# EAGLE design mega (EAGLE 6.6.0)
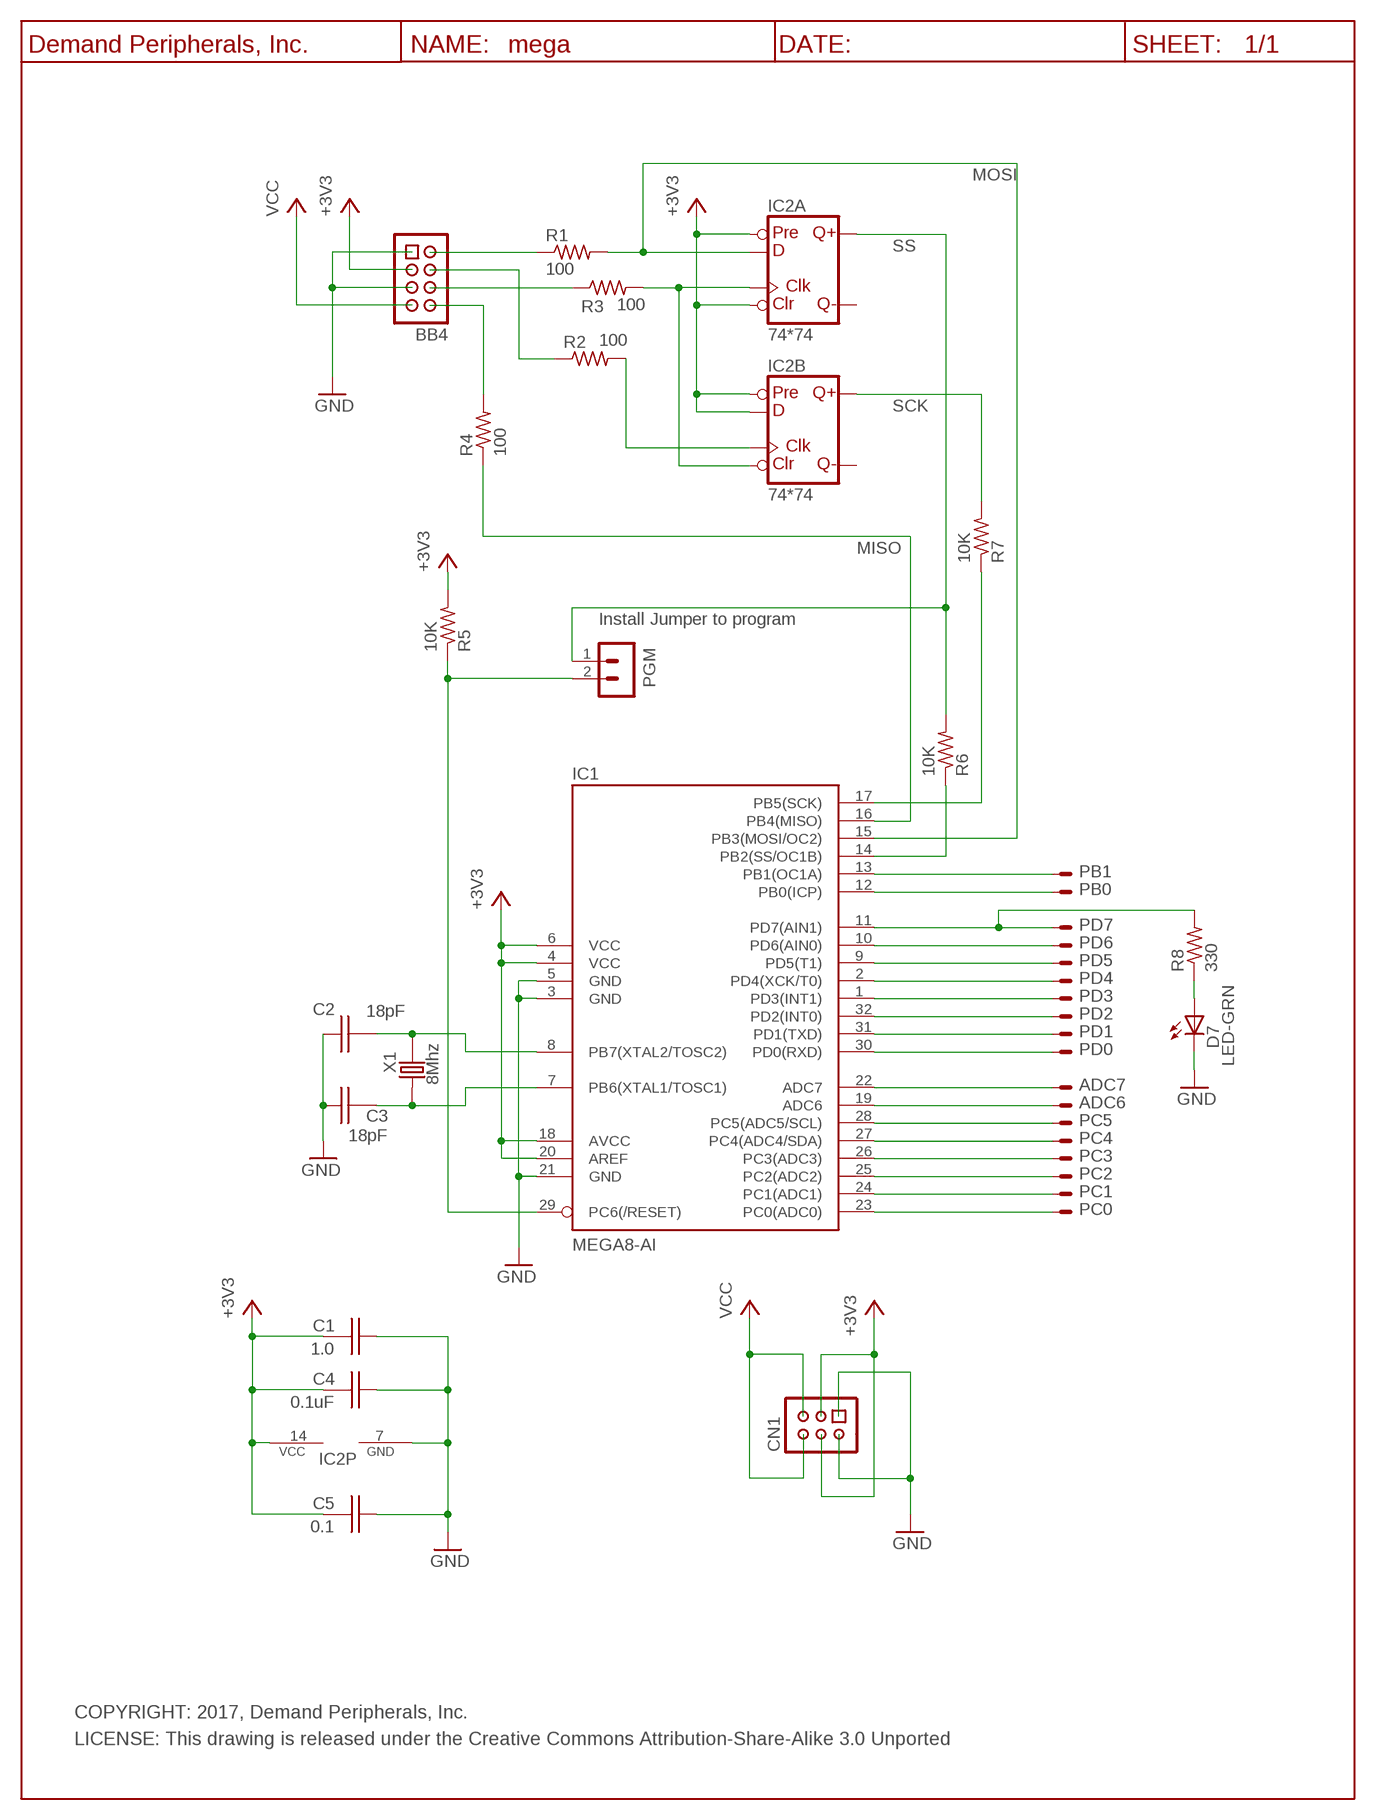
[diagram p0: schematic, sheet 1]

## Parts
ADC6  PinHdr254-1(Option)  PAD1  [PAD1]
ADC7  PinHdr254-1(Option)  PAD1  [PAD1]
BB4  BB4_CON  HDR-4X2-SHR  [HDR-4X2]
C1  1.0  C1.0UF_C0603  [C0603]
C2  18pF  C18PF_C0603  [C0603]
C3  18pF  C18PF_C0603  [C0603]
C4  0.1uF  C0.1UF_C0603  [C0603]
C5  0.1  C0.1UF_C0603  [C0603]
CN1  HDR-3X2  [HDR-3X2]
D7  LED-GRN  LED-0805-GRN  [0805]
IC1  MEGA8-AI  [TQFP32-08]
IC2  74*74  74AHC74TS  [TSSOP14]
PB0  PinHdr254-1(Option)  PAD1  [PAD1]
PB1  PinHdr254-1(Option)  PAD1  [PAD1]
PC0  PinHdr254-1(Option)  PAD1  [PAD1]
PC1  PinHdr254-1(Option)  PAD1  [PAD1]
PC2  PinHdr254-1(Option)  PAD1  [PAD1]
PC3  PinHdr254-1(Option)  PAD1  [PAD1]
PC4  PinHdr254-1(Option)  PAD1  [PAD1]
PC5  PinHdr254-1(Option)  PAD1  [PAD1]
PD0  PinHdr254-1(Option)  PAD1  [PAD1]
PD1  PinHdr254-1(Option)  PAD1  [PAD1]
PD2  PinHdr254-1(Option)  PAD1  [PAD1]
PD3  PinHdr254-1(Option)  PAD1  [PAD1]
PD4  PinHdr254-1(Option)  PAD1  [PAD1]
PD5  PinHdr254-1(Option)  PAD1  [PAD1]
PD6  PinHdr254-1(Option)  PAD1  [PAD1]
PD7  PinHdr254-1(Option)  PAD1  [PAD1]
PGM  PinHdr254-2  HDR-2X1-LCK  [HDR-2X1]
R1  100  R100_R0603  [R0603]
R2  100  R100_R0603  [R0603]
R3  100  R100_R0603  [R0603]
R4  100  R100_R0603  [R0603]
R5  10K  R10K_R0603  [R0603]
R6  10K  R10K_R0603  [R0603]
R7  10K  R10K_R0603  [R0603]
R8  330  R330_R0603  [R0603]
U$1  DP_FRAME_P  [P_FRAME]
X1  8Mhz  NX5032-8MM5X32  [NX5032]

## Nets
+3V3: BB4.3 C1.2 C4.2 C5.2 CN1.3 CN1.4 IC1.4(VCC) IC1.6(VCC) IC1.18(AVCC) IC1.20(AREF) IC2.1(A:CLR) IC2.4(A:PRE) IC2.10(B:PRE) IC2.12(B:D) IC2.14(P:VCC) R5.2
GND: BB4.1 BB4.5 C1.1 C2.1 C3.1 C4.1 C5.1 CN1.1 CN1.2 D7.C IC1.3(GND) IC1.5(GND) IC1.21(GND) IC2.7(P:GND)
N$1: IC1.29(PC6(/RESET)) PGM.2 R5.1
N$2: D7.A R8.1
N$3: C3.2 IC1.7(PB6(XTAL1/TOSC1)) X1.2
N$4: C2.2 IC1.8(PB7(XTAL2/TOSC2)) X1.1
N$14: IC1.23(PC0(ADC0)) PC0.1
N$18: IC1.26(PC3(ADC3)) PC3.1
N$19: IC1.24(PC1(ADC1)) PC1.1
N$20: IC1.25(PC2(ADC2)) PC2.1
N$21: IC1.27(PC4(ADC4/SDA)) PC4.1
N$22: IC1.28(PC5(ADC5/SCL)) PC5.1
N$23: ADC6.1 IC1.19(ADC6)
N$24: ADC7.1 IC1.22(ADC7)
N$25: IC1.30(PD0(RXD)) PD0.1
N$26: IC1.31(PD1(TXD)) PD1.1
N$27: IC1.32(PD2(INT0)) PD2.1
N$28: IC1.1(PD3(INT1)) PD3.1
N$29: IC1.2(PD4(XCK/T0)) PD4.1
N$30: IC1.9(PD5(T1)) PD5.1
N$31: IC1.10(PD6(AIN0)) PD6.1
N$32: IC1.11(PD7(AIN1)) PD7.1 R8.2
N$33: IC1.12(PB0(ICP)) PB0.1
N$34: IC1.13(PB1(OC1A)) PB1.1
N$154: BB4.2 R1.1
N$155: IC1.15(PB3(MOSI/OC2)) IC2.2(A:D) R1.2
N$156: BB4.4 R2.1
N$157: IC2.11(B:CLK) R2.2
N$158: IC2.3(A:CLK) IC2.13(B:CLR) R3.2
N$159: BB4.6 R3.1
N$160: IC2.9(B:Q) R7.2
N$161: IC2.5(A:Q) PGM.1 R6.2
N$162: IC1.16(PB4(MISO)) R4.1
N$163: BB4.8 R4.2
N$165: IC1.14(PB2(SS/OC1B)) R6.1
N$166: IC1.17(PB5(SCK)) R7.1
VCC: BB4.7 CN1.5 CN1.6
Unconnected: IC2.6(A:!Q) IC2.8(B:!Q)

## Notes on the sheet
- MOSI
- SS
- SCK
- MISO
- Install Jumper to program
- COPYRIGHT: 2017, Demand Peripherals, Inc.
- LICENSE: This drawing is released under the Creative Commons Attribution-Share-Alike 3.0 Unported

## Library data of the parts
ADC6 ADC7 PB0 PB1 PC0 PC1-PC5 PD0 PD1-PD7 = dpi-conn:PAD1: WW PAD
BB4 = dpi-conn:HDR-4X2-SHR: Shrouded 4x2 pin header; VENDOR: Digikey; VENDOR-PART-NUM: 609-3530-ND
C1 = dpi-passive:C1.0UF_: 1.0 uF Capacitor, 25V, Y5V; VENDOR: Digikey; VENDOR-PART-NUM: 490-3897-2-ND
C2 C3 = dpi-passive:C18PF_: 18 pF Capacitor, 50V; VENDOR: Digikey; VENDOR-PART-NUM: 311-1061-1-ND
C4 C5 = dpi-passive:C0.1UF_: 0.1 uF Capacitor, 25V, X7R; VENDOR: Digikey; VENDOR-PART-NUM: 1276-1126-2-ND
CN1 = dpi-conn:HDR-3X2: Unshrouded 3x2 header with 0.1 inch pitch; VENDOR: Digikey; VENDOR-PART-NUM: 952-2120-ND
D7 = dpi-diopto:LED-0805-GRN: Green 0805 LED, 26mcd@20ma, 160degree; VENDOR: Digikey; VENDOR-PART-NUM: 475-1410-1-ND
IC1 = dpi-transic:MEGA8: Atmel ARV Mega8
IC2 = dpi-transic:74AHC74: Dual D type positive edge triggered FLIP FLOP, preset and clear; VENDOR: Digikey; VENDOR-PART-NUM: MC74HC74ADTR2GOSCT-ND
PGM = dpi-conn:HDR-2X1-LCK: 2x1 pin header with friction lock; VENDOR: Mouser; VENDOR-PART-NUM: 571-6404562
R1-R4 = dpi-passive:R100_: 100 Ohm resistor, 1%, 0.1 watt; VENDOR: Digikey; VENDOR-PART-NUM: 311-100HRTR-ND
R5-R7 = dpi-passive:R10K_: 10K Resistor, 1%, 0.1 watt; VENDOR: Digikey; VENDOR-PART-NUM: 311-1.00KHRTR-ND
R8 = dpi-passive:R330_: 330 Ohm resistor, 1%, 0.1 watt; VENDOR: Digikey; VENDOR-PART-NUM: 311-330HRTR-ND
U$1 = dpi-sym:DP_FRAME_P: Portrait/Letter Document Frame
X1 = dpi-passive:NX5032-8: NDK 8 MHz crystal; VENDOR: Digikey; VENDOR-PART-NUM: 644-1318-1-ND

## Board
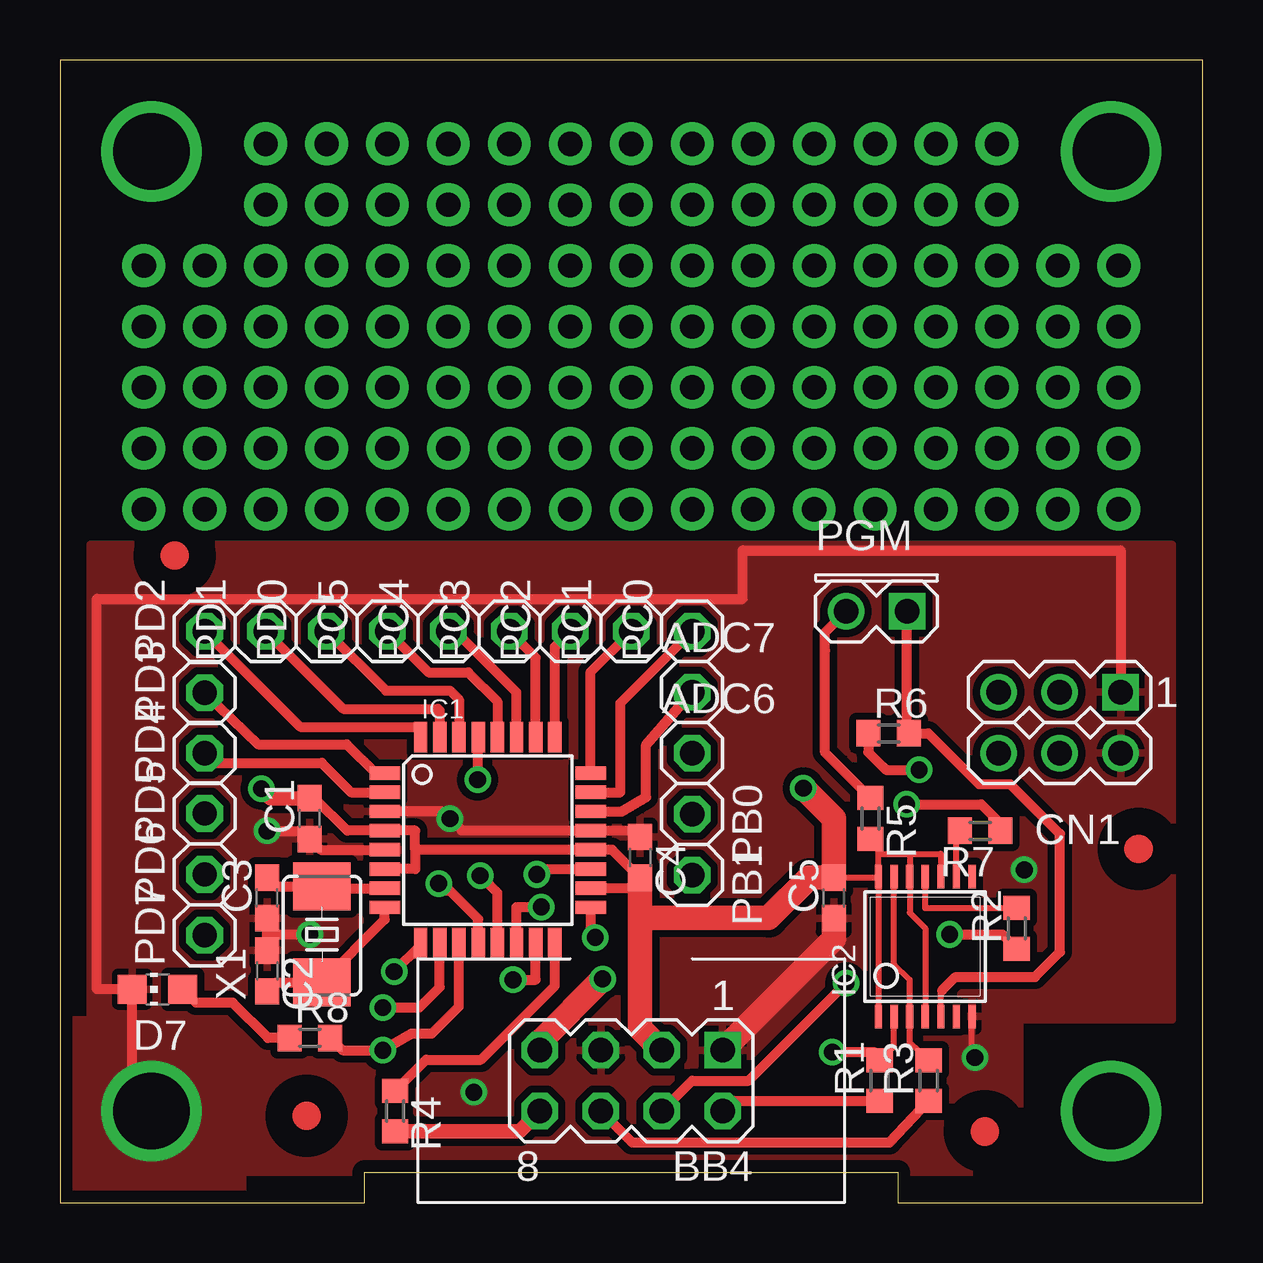
[diagram p1: board, top side]
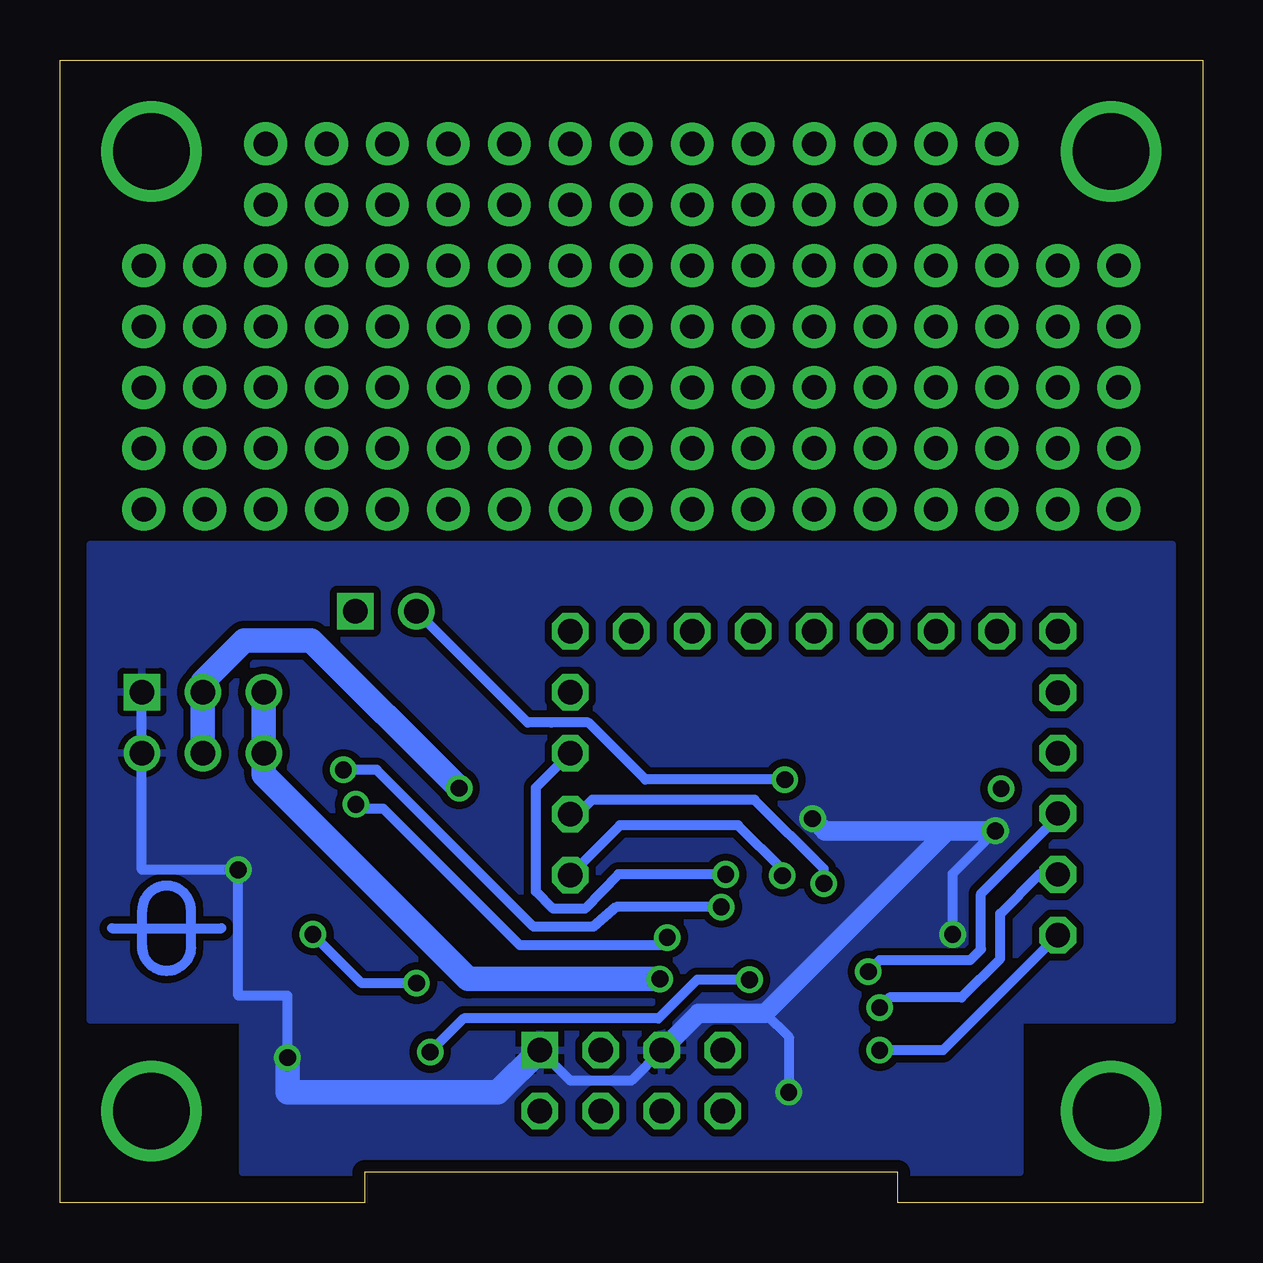
[diagram p2: board, bottom side, seen from below]

Size 47.62 x 47.62 mm. Coordinates in mm from the lower left corner, seen from the top.
Outline: 0,0 12.7,0 12.7,1.27 34.92,1.27 34.92,0 47.62,0 47.62,47.62 0,47.62 0,0
Copper layers (1*16): Top 0.035mm / dielectric 1.5mm / Bottom 0.035mm
Design rules "default": minimum track width 10mil, minimum drill 24mil, track to track 8mil, track to pad 8mil, pad to pad 8mil, via to via 8mil, smd to smd 8mil, copper to edge 20mil, drill to drill 12mil, minimum pad ring 10mil, minimum via ring 8mil, stop-mask expansion 4mil, vias tented up to drill 0mil, thermal gap 10mil
tKeepout: area 15.1,1 to 32.5,9.7; area 15.1,1 to 32.5,9.7

### Footprints (pad centres in the part's own frame; a part is rotated, then mirrored left to right if it is on the bottom)
PAD1 = drill 1.016 octagon: 1 0,0
HDR-4X2 = drill 1.016 square: 1 -3.81,-1.27 | drill 1.016 octagon: 2 -3.81,1.27; 3 -1.27,-1.27; 4 -1.27,1.27; 5 1.27,-1.27; 6 1.27,1.27; 7 3.81,-1.27; 8 3.81,1.27
C0603 = smd 1.1 x 1: 1 -0.85,0; 2 0.85,0
HDR-3X2 = drill 1.016 square: 1 -2.54,-1.27 | drill 1.016: 2 -2.54,1.27; 3 0,-1.27; 4 0,1.27; 5 2.54,-1.27; 6 2.54,1.27
0805 = smd 1.2 x 1.2: A 0,-1.05; C 0,1.05
TQFP32-08 = smd 1.27 x 0.559: 1 -4.293,2.8; 2 -4.293,2; 3 -4.293,1.2; 4 -4.293,0.4; 5 -4.293,-0.4; 6 -4.293,-1.2; 7 -4.293,-2; 8 -4.293,-2.8; 17 4.293,-2.8; 18 4.293,-2; 19 4.293,-1.2; 20 4.293,-0.4; 21 4.293,0.4; 22 4.293,1.2; 23 4.293,2; 24 4.293,2.8 | smd 0.559 x 1.27: 9 -2.8,-4.293; 10 -2,-4.293; 11 -1.2,-4.293; 12 -0.4,-4.293; 13 0.4,-4.293; 14 1.2,-4.293; 15 2,-4.293; 16 2.8,-4.293; 25 2.8,4.293; 26 2,4.293; 27 1.2,4.293; 28 0.4,4.293; 29 -0.4,4.293; 30 -1.2,4.293; 31 -2,4.293; 32 -2.8,4.293
TSSOP14 = smd 0.305 x 0.991: 1 -1.95,-2.918; 2 -1.3,-2.918; 3 -0.65,-2.918; 4 0,-2.918; 5 0.65,-2.918; 6 1.3,-2.918; 7 1.95,-2.918; 8 1.95,2.918; 9 1.3,2.918; 10 0.65,2.918; 11 0,2.918; 12 -0.65,2.918; 13 -1.3,2.918; 14 -1.95,2.918
HDR-2X1 = drill 1.016 square: 1 1.27,0 | drill 1.016: 2 -1.27,0
R0603 = smd 1 x 1.1: 1 -0.85,0; 2 0.85,0
NX5032 = smd 2 x 2.4: 1 -2,0; 2 2,0

### Placement (x,y rotation side)
ADC6  26.35,18.73 0 top
ADC7  26.35,21.27 0 top
BB4  23.81,5.08 180 top
C1  10.41,16 90 top
C2  8.64,9.65 270 top
C3  8.64,12.7 90 top
C4  24.17,14.39 270 top
C5  32.26,12.7 90 top
CN1  41.67,20 180 top
D7  4.06,8.89 90 top
IC1  17.83,15.1 0 top
IC2  36.07,10.67 0 top
PB0  26.35,16.19 270 top
PB1  26.35,13.65 270 top
PC0  26.35,23.81 90 top
PC1  23.81,23.81 90 top
PC2  21.27,23.81 90 top
PC3  18.73,23.81 90 top
PC4  16.19,23.81 90 top
PC5  13.65,23.81 90 top
PD0  11.11,23.81 90 top
PD1  8.57,23.81 90 top
PD2  6.03,23.81 90 top
PD3  6.03,21.25 90 top
PD4  6.03,18.73 90 top
PD5  6.03,16.22 90 top
PD6  6.03,13.68 90 top
PD7  6.03,11.14 90 top
PGM  34.04,24.64 0 top
R1  34.16,5.08 90 top
R2  39.88,11.43 90 top
R3  36.21,5.08 90 top
R4  13.97,3.81 270 top
R5  33.78,16.01 270 top
R6  34.54,19.56 0 top
R7  38.35,15.49 180 top
R8  10.41,6.86 0 top
U$1  0,0 0 top
U$2  [DPI-1]  43.18,11.43 90 bottom
U$4  [FIDUCIAL]  10.29,3.61 0 top
U$5  [FIDUCIAL]  38.56,2.96 0 top
U$6  [FIDUCIAL]  44.96,14.73 0 top
U$7  [FIDUCIAL]  4.78,26.97 0 top
X1  10.92,11.18 90 top

### Tracks (layer width: path | path; a pad name or v marks a point on that pad's centre or on a via)
+3V3  (via drill 0.7)
  Top 0.254: 34.12,14.54 IC2.14 34.08,13.55 | 34.12,14.54 34.12,14.83 R5.2 | C5.2 34.08,13.55 | IC2.10 36.72,14.54 35.42,14.54 | 35.42,14.54 IC2.12 35.42,12.08 36.07,11.43 IC2.4 | 34.12,14.54 35.42,14.54 | 34.08,13.55 34.12,13.51 IC2.1
  Top 0.406: IC1.6 14.81,13.9 14.81,14.7 | 14.81,14.7 14.81,15.5 IC1.4 11.97,15.5 10.62,16.85 C1.2 | 14.81,14.7 IC1.20 23.01,14.7 C4.2 23.73,13.1 IC1.18
  Top 0.61: v8.39,17.25 8.79,16.85 C1.2
  Top 1.016: BB4.3 24.17,7.26 C4.2 24.17,11.86 29.54,11.86 31.23,13.55 C5.2 32.26,16 v30.99,17.27
  Bottom 1.016: v30.99,17.27 37.15,23.43 37.35,23.43 39.94,23.43 41.67,21.7 CN1.3 CN1.4
GND  (via drill 0.7, 3.17 pad 3.17)
  Top 0.254: IC2.7 38.02,6.17 v38.14,6.04
  Top 0.406: IC1.5 10.87,14.7 C1.1 10.07,15.49 v8.64,15.49 | IC1.3 15.96,16.3 v16.26,16 16.76,15.5 IC1.21 23.91,15.5 C4.1 | C2.1 C3.1 8.64,11.18 v10.41,11.18 | v3.81,3.81 3.01,4.61 D7.C 1.54,8.89 1.54,25.16 28.46,25.16 28.46,27.18 44.21,27.18 CN1.1
  Top 1.016: C5.1 32.26,10.99 BB4.1
  Bottom 0.406: v10.41,11.18 10.41,13.72 v8.64,15.49 | BB4.5 23.81,5.08 26.35,5.08 BB4.1 | 18.24,7.89 17.25,6.9 v17.25,4.6 | v38.14,6.04 38.14,8.62 40.2,8.62 v40.2,13.87 44.13,13.87 44.21,13.87 CN1.2 CN1.1
  Bottom 0.813: BB4.5 21.01,7.89 18.24,7.89 10.63,15.49 v8.64,15.49 15.75,15.49 v16.26,16
  Bottom 1.016: v38.14,6.04 38.14,4.58 29.39,4.58 BB4.1
  pour Bottom (isolate 0.305): 1.27,7.62 1.27,27.43 46.35,27.43 46.35,7.62 40.01,7.62 40.01,1.27 7.62,1.27 7.62,7.62
  pour Top (isolate 0.305): 1.27,7.62 1.27,27.43 46.35,27.43 46.35,7.62 40.01,7.62 40.01,1.27 7.62,1.27 7.62,0.51 0.51,0.51 0.51,7.62
MOUNT  (via drill 3.17 pad 3.17)
  other vias: 43.81,43.81
N$1  (via drill 0.7)
  Top 0.406: IC1.29 17.43,17.65 v17.41,17.63 | R5.1 31.89,18.76 31.89,23 31.89,23.76 PGM.2
  Bottom 0.406: v17.41,17.63 23.23,17.63 25.6,20 27.14,20 28.13,20 PGM.2
N$2
  Top 0.406: R8.1 8.67,6.86 7.2,8.33 5.67,8.33 D7.A
N$3
  Top 0.406: IC1.7 11,13.1 X1.2 9.01,13.18 C3.2
N$4
  Top 0.406: IC1.8 13.54,11.79 X1.1 9.01,9.18 C2.2
N$5  (via drill 1.02 pad 1.78)
  other vias: 23.81,28.89
N$6  (via drill 1.02 pad 1.78)
  other vias: 44.13,28.89
N$7  (via drill 1.02 pad 1.78)
  other vias: 6.03,31.43
N$8  (via drill 1.02 pad 1.78)
  other vias: 28.89,31.43
N$9  (via drill 1.02 pad 1.78)
  other vias: 23.81,33.97
N$11  (via drill 1.02 pad 1.78)
  other vias: 44.13,33.97
N$12  (via drill 1.02 pad 1.78)
  other vias: 6.03,36.51
N$13  (via drill 1.02 pad 1.78)
  other vias: 28.89,36.51
N$14
  Top 0.406: IC1.23 23.36,17.1 23.36,20.82 PC0.1
N$15  (via drill 1.02 pad 1.78)
  other vias: 23.81,39.05
N$16  (via drill 1.02 pad 1.78)
  other vias: 44.13,39.05
N$17  (via drill 1.02 pad 1.78)
  other vias: 23.81,41.59
N$18
  Top 0.406: IC1.26 19.83,22.71 PC3.1
N$19
  Top 0.406: IC1.24 22.12,22.12 PC1.1
N$20
  Top 0.406: IC1.25 20.63,23.17 PC2.1
N$21
  Top 0.406: IC1.27 19.03,21.27 16.48,23.81 PC4.1
N$22
  Top 0.406: IC1.28 18.23,20.89 17.02,22.1 15.37,22.1 PC5.1
N$23  (via drill 0.7)
  Top 0.406: v19.88,13.68 20.14,13.9 IC1.19
  Bottom 0.406: ADC6.1 27.79,17.3 27.79,12.97 27.06,12.24 25.74,12.24 24.35,13.68 v19.88,13.68
N$24
  Top 0.406: IC1.22 23.41,16.3 24.43,16.9 24.43,19.07 ADC7.1
N$25
  Top 0.406: IC1.30 16.63,20.96 16.26,21.34 13.59,21.34 PD0.1
N$26
  Top 0.406: IC1.31 15.83,20.49 15.75,20.57 11.81,20.57 PD1.1
N$27
  Top 0.406: IC1.32 15.03,19.82 10.02,19.82 PD2.1
N$28
  Top 0.406: IC1.1 13.15,17.9 11.95,19.1 8.26,19.1 PD3.1
N$29
  Top 0.406: IC1.2 12.13,17.1 10.91,18.33 6.51,18.33 PD4.1
N$30  (via drill 0.7)
  Top 0.406: IC1.9 15.03,10.73 v13.93,9.63
  Bottom 0.406: v13.93,9.63 13.46,10.1 9.69,10.1 9.23,10.55 9.23,12.87 6.11,15.99 PD5.1
N$31  (via drill 0.7)
  Top 0.406: IC1.10 15.83,8.97 14.99,8.13 v13.46,8.13
  Bottom 0.406: PD6.1 6.79,13.68 8.43,12.04 8.43,10.16 10.05,8.55 13.04,8.55 v13.46,8.13
N$32  (via drill 0.7)
  Top 0.406: IC1.11 16.63,8.17 15.49,7.04 14.66,7.04 v13.46,6.35 11.77,6.35 R8.2
  Bottom 0.406: PD7.1 10.82,6.35 v13.46,6.35
N$33  (via drill 0.7)
  Top 0.406: IC1.12 17.43,11.82 16.26,12.99 16.09,12.99 v15.79,13.3
  Bottom 0.406: PB0.1 26.04,16.19 25.44,16.79 18.67,16.79 15.79,13.91 v15.79,13.3
N$34  (via drill 0.7)
  Top 0.406: IC1.13 18.23,12.91 v17.51,13.63
  Bottom 0.406: v17.51,13.63 17.51,13.88 19.36,15.72 24.28,15.72 PB1.1
N$36  (via drill 1.02 pad 1.78)
  other vias: 28.89,41.59
N$37  (via drill 1.02 pad 1.78)
  other vias: 23.81,44.13
N$38  (via drill 1.02 pad 1.78)
  other vias: 39.05,44.13
N$39  (via drill 1.02 pad 1.78)
  other vias: 8.57,41.59
N$40  (via drill 1.02 pad 1.78)
  other vias: 8.57,44.13
N$41  (via drill 1.02 pad 1.78)
  other vias: 11.11,44.13
N$42  (via drill 1.02 pad 1.78)
  other vias: 11.11,41.59
N$43  (via drill 1.02 pad 1.78)
  other vias: 13.65,41.59
N$44  (via drill 1.02 pad 1.78)
  other vias: 13.65,44.13
N$45  (via drill 1.02 pad 1.78)
  other vias: 16.19,44.13
N$46  (via drill 1.02 pad 1.78)
  other vias: 16.19,41.59
N$47  (via drill 3.17 pad 3.17)
  other vias: 3.81,43.81
N$48  (via drill 1.02 pad 1.78)
  other vias: 18.73,41.59
N$49  (via drill 1.02 pad 1.78)
  other vias: 18.73,44.13
N$50  (via drill 1.02 pad 1.78)
  other vias: 21.27,44.13
N$51  (via drill 1.02 pad 1.78)
  other vias: 21.27,41.59
N$52  (via drill 1.02 pad 1.78)
  other vias: 26.35,44.13
N$53  (via drill 1.02 pad 1.78)
  other vias: 28.89,44.13
N$54  (via drill 1.02 pad 1.78)
  other vias: 31.43,44.13
N$55  (via drill 1.02 pad 1.78)
  other vias: 33.97,44.13
N$56  (via drill 1.02 pad 1.78)
  other vias: 36.51,44.13
N$57  (via drill 1.02 pad 1.78)
  other vias: 39.05,41.59
N$58  (via drill 1.02 pad 1.78)
  other vias: 36.51,41.59
N$59  (via drill 1.02 pad 1.78)
  other vias: 33.97,41.59
N$60  (via drill 1.02 pad 1.78)
  other vias: 31.43,41.59
N$61  (via drill 1.02 pad 1.78)
  other vias: 26.35,41.59
N$70  (via drill 3.17 pad 3.17)
  other vias: 43.81,3.81
N$72  (via drill 1.02 pad 1.78)
  other vias: 3.49,39.05
N$73  (via drill 1.02 pad 1.78)
  other vias: 6.03,39.05
N$74  (via drill 1.02 pad 1.78)
  other vias: 8.57,39.05
N$75  (via drill 1.02 pad 1.78)
  other vias: 11.11,39.05
N$76  (via drill 1.02 pad 1.78)
  other vias: 13.65,39.05
N$77  (via drill 1.02 pad 1.78)
  other vias: 16.19,39.05
N$78  (via drill 1.02 pad 1.78)
  other vias: 18.73,39.05
N$79  (via drill 1.02 pad 1.78)
  other vias: 21.27,39.05
N$80  (via drill 1.02 pad 1.78)
  other vias: 26.35,39.05
N$81  (via drill 1.02 pad 1.78)
  other vias: 28.89,39.05
N$82  (via drill 1.02 pad 1.78)
  other vias: 31.43,39.05
N$83  (via drill 1.02 pad 1.78)
  other vias: 33.97,39.05
N$84  (via drill 1.02 pad 1.78)
  other vias: 36.51,39.05
N$85  (via drill 1.02 pad 1.78)
  other vias: 39.05,39.05
N$86  (via drill 1.02 pad 1.78)
  other vias: 41.59,39.05
N$87  (via drill 1.02 pad 1.78)
  other vias: 44.13,36.51
N$88  (via drill 1.02 pad 1.78)
  other vias: 41.59,36.51
N$89  (via drill 1.02 pad 1.78)
  other vias: 39.05,36.51
N$90  (via drill 1.02 pad 1.78)
  other vias: 36.51,36.51
N$91  (via drill 1.02 pad 1.78)
  other vias: 33.97,36.51
N$92  (via drill 1.02 pad 1.78)
  other vias: 31.43,36.51
N$93  (via drill 1.02 pad 1.78)
  other vias: 26.35,36.51
N$94  (via drill 1.02 pad 1.78)
  other vias: 23.81,36.51
N$95  (via drill 1.02 pad 1.78)
  other vias: 21.27,36.51
N$96  (via drill 1.02 pad 1.78)
  other vias: 18.73,36.51
N$97  (via drill 1.02 pad 1.78)
  other vias: 16.19,36.51
N$98  (via drill 1.02 pad 1.78)
  other vias: 13.65,36.51
N$99  (via drill 1.02 pad 1.78)
  other vias: 11.11,36.51
N$100  (via drill 1.02 pad 1.78)
  other vias: 8.57,36.51
N$101  (via drill 1.02 pad 1.78)
  other vias: 3.49,36.51
N$102  (via drill 1.02 pad 1.78)
  other vias: 3.49,33.97
N$103  (via drill 1.02 pad 1.78)
  other vias: 6.03,33.97
N$104  (via drill 1.02 pad 1.78)
  other vias: 8.57,33.97
N$105  (via drill 1.02 pad 1.78)
  other vias: 11.11,33.97
N$106  (via drill 1.02 pad 1.78)
  other vias: 13.65,33.97
N$107  (via drill 1.02 pad 1.78)
  other vias: 16.19,33.97
N$108  (via drill 1.02 pad 1.78)
  other vias: 18.73,33.97
N$109  (via drill 1.02 pad 1.78)
  other vias: 21.27,33.97
N$110  (via drill 1.02 pad 1.78)
  other vias: 26.35,33.97
N$111  (via drill 1.02 pad 1.78)
  other vias: 28.89,33.97
N$112  (via drill 1.02 pad 1.78)
  other vias: 31.43,33.97
N$113  (via drill 1.02 pad 1.78)
  other vias: 33.97,33.97
N$114  (via drill 1.02 pad 1.78)
  other vias: 36.51,33.97
N$115  (via drill 1.02 pad 1.78)
  other vias: 39.05,33.97
N$116  (via drill 1.02 pad 1.78)
  other vias: 41.59,33.97
N$117  (via drill 1.02 pad 1.78)
  other vias: 44.13,31.43
N$118  (via drill 1.02 pad 1.78)
  other vias: 41.59,31.43
N$119  (via drill 1.02 pad 1.78)
  other vias: 39.05,31.43
N$120  (via drill 1.02 pad 1.78)
  other vias: 36.51,31.43
N$121  (via drill 1.02 pad 1.78)
  other vias: 33.97,31.43
N$122  (via drill 1.02 pad 1.78)
  other vias: 31.43,31.43
N$123  (via drill 1.02 pad 1.78)
  other vias: 26.35,31.43
N$124  (via drill 1.02 pad 1.78)
  other vias: 23.81,31.43
N$125  (via drill 1.02 pad 1.78)
  other vias: 21.27,31.43
N$126  (via drill 1.02 pad 1.78)
  other vias: 18.73,31.43
N$127  (via drill 1.02 pad 1.78)
  other vias: 16.19,31.43
N$128  (via drill 1.02 pad 1.78)
  other vias: 13.65,31.43
N$129  (via drill 1.02 pad 1.78)
  other vias: 11.11,31.43
N$130  (via drill 1.02 pad 1.78)
  other vias: 8.57,31.43
N$131  (via drill 1.02 pad 1.78)
  other vias: 3.49,31.43
N$132  (via drill 1.02 pad 1.78)
  other vias: 3.49,28.89
N$133  (via drill 1.02 pad 1.78)
  other vias: 6.03,28.89
N$134  (via drill 1.02 pad 1.78)
  other vias: 8.57,28.89
N$135  (via drill 1.02 pad 1.78)
  other vias: 11.11,28.89
N$136  (via drill 1.02 pad 1.78)
  other vias: 13.65,28.89
N$137  (via drill 1.02 pad 1.78)
  other vias: 16.19,28.89
N$138  (via drill 1.02 pad 1.78)
  other vias: 18.73,28.89
N$139  (via drill 1.02 pad 1.78)
  other vias: 21.27,28.89
N$140  (via drill 1.02 pad 1.78)
  other vias: 26.35,28.89
N$141  (via drill 1.02 pad 1.78)
  other vias: 28.89,28.89
N$142  (via drill 1.02 pad 1.78)
  other vias: 31.43,28.89
N$143  (via drill 1.02 pad 1.78)
  other vias: 33.97,28.89
N$144  (via drill 1.02 pad 1.78)
  other vias: 36.51,28.89
N$145  (via drill 1.02 pad 1.78)
  other vias: 39.05,28.89
N$146  (via drill 1.02 pad 1.78)
  other vias: 41.59,28.89
N$154
  Top 0.406: BB4.2 28.04,4.23 R1.1
N$155  (via drill 0.7)
  Top 0.254: IC2.2 34.77,6.48 R1.2
  Top 0.406: IC1.15 19.83,9.28 v18.89,9.28 | v32.19,6.27 33.95,6.27 R1.2
  Bottom 0.406: v18.89,9.28 21.07,9.28 22.68,7.67 30.8,7.67 v32.19,6.27
N$156  (via drill 0.7)
  Top 0.406: BB4.4 26.35,5.08 28.7,5.08 v32.77,9.14 | v37.08,11.18 39.28,11.18 R2.1
  Bottom 0.406: v32.77,9.14 35.05,9.14 v37.08,11.18
N$157
  Top 0.254: IC2.11 36.07,12.28 R2.2
N$158
  Top 0.254: IC2.13 34.77,9.94 35.42,9.29 IC2.3 35.42,6.66 R3.2
N$159
  Top 0.406: BB4.6 23.85,2.5 34.58,2.5 R3.1
N$160
  Top 0.254: IC2.9 37.37,15.49 R7.2
N$161
  Top 0.254: 36.77,8.84 36.72,8.79 IC2.5
  Top 0.406: 36.77,8.84 37.33,9.4 40.64,9.4 41.68,10.44 41.68,15.37 39.61,17.44 38.32,17.44 36.2,19.56 R6.2 35.31,19.65 PGM.1
N$162
  Top 0.406: IC1.16 20.63,9.04 17.55,5.96 15.27,5.96 R4.1
N$163
  Top 0.61: BB4.8 19.15,2.96 R4.2
N$165  (via drill 0.7)
  Top 0.406: IC1.14 19.03,12.32 v20.07,12.32 | R6.1 33.69,18.77 34.33,18.14 34.43,18.03 v35.81,18.03
  Bottom 0.406: v35.81,18.03 34.42,18.03 27.88,11.49 25.4,11.49 24.45,12.32 v20.07,12.32
N$166  (via drill 0.7)
  Top 0.406: v35.29,16.6 38.41,16.6 39.18,15.82 R7.1 | IC1.17 22.12,11.24 v22.31,11.05
  Bottom 0.406: v35.29,16.6 35.1,16.41 34.14,16.41 28.45,10.72 22.42,10.72 22.31,10.82 v22.31,11.05
VCC  (via drill 0.7)
  Top 1.016: BB4.7 20,6.71 v22.62,9.32
  Bottom 1.016: v22.62,9.32 30.61,9.32 39.05,17.77 39.13,17.84 CN1.6 CN1.5

### Text on the board
tTest: 1.875 Inches | 1.575 Inches | (C) 2017, Demand Peripherals, Inc. | MEGA, Rev 17a | D1 | D0 | C5 | C4 | C3 | C2 | C1 | C0 | D2 | 5.0V | 3.3V | Gnd | Pgm | D3 | C7 | R6 | IC1 | D4 | C6 | D5 | B0 | C1 | R5 | R7 | 1.575 Inches | 1.875 Inches | D6 | B1 | C3 | C4 | C5 | D7 | Q1 | R2 | BB4 | IC2 | C2 | R8 | R4 | R1 | R3